# Altium project Firewatch.PrjPcb
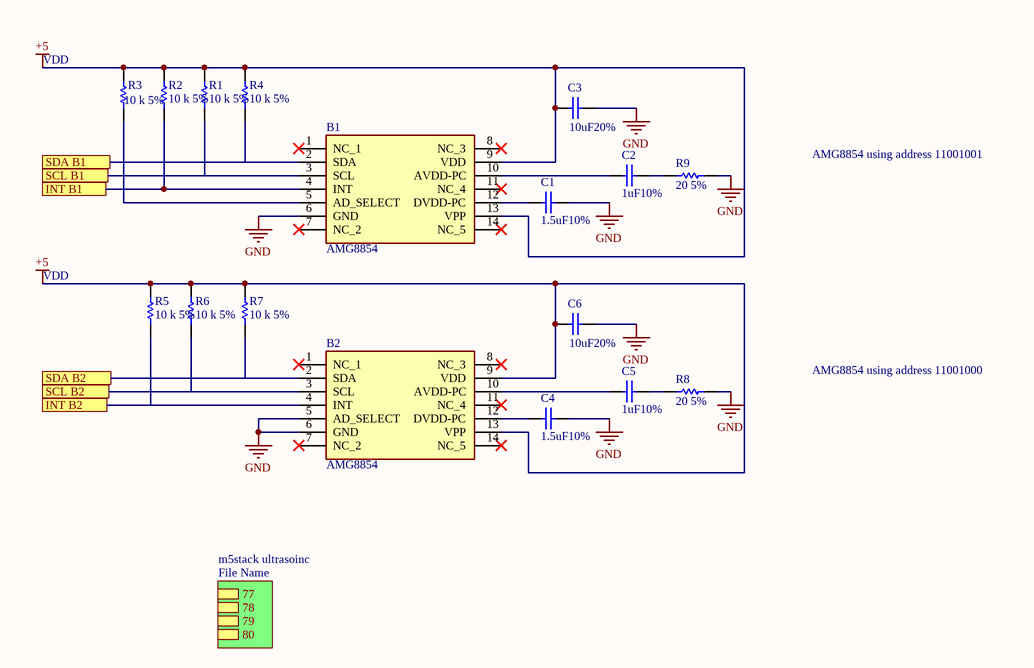
[diagram p0: Grideye.SchDoc]
6 sheets, 42 parts. Net scope: hierarchical (ports join the sheet entries above them; power ports are global).
Board file: PCB1.PcbDoc
Sheets:
  Grideye.SchDoc
  BoschIMU.SchDoc
  MicrochipUWB.SchDoc
  ublox_GPS.SchDoc
  pressure.SchDoc
  ublox_wifi.SchDoc

## Sheet Grideye.SchDoc
size A4; SheetNumber: 1; SheetTotal: 8

### Parts
B1  AMG8854  [AMG8854]
B2  AMG8854  [AMG8854]
C1  value 1.5uF10%  (hidden comment: Capacitor)
C2  value 1uF10%  (hidden comment: Capacitor)
C3  value 10uF20%  (hidden comment: Capacitor)
C4  value 1.5uF10%  (hidden comment: Capacitor)
C5  value 1uF10%  (hidden comment: Capacitor)
C6  value 10uF20%  (hidden comment: Capacitor)
R1  value 10 k 5%  (hidden comment: Resistor)
R2  value 10 k 5%  (hidden comment: Resistor)
R3  value 10 k 5%  (hidden comment: Resistor)
R4  value 10 k 5%  (hidden comment: Resistor)
R5  value 10 k 5%  (hidden comment: Resistor)
R6  value 10 k 5%  (hidden comment: Resistor)
R7  value 10 k 5%  (hidden comment: Resistor)
R8  value 20 5%  (hidden comment: Resistor)
R9  value 20 5%  (hidden comment: Resistor)

### Sub-sheets
m5stack ultrasoinc = File Name (file not in this document): 77, 78, 79, 80

### Ports
INT B1, INT B2, SCL B1, SCL B2, SDA B1, SDA B2

### Nets
+5: B1.9(VDD) B1.13(VPP) B2.9(VDD) B2.13(VPP) C3.1 C6.1 R1.2 R2.2 R3.2 R4.2 R5.2 R6.2 R7.2
GND: B1.6(GND) B2.5(AD_SELECT) B2.6(GND) C1.2 C3.2 C4.2 C6.2 R8.2 R9.2
NetB1_2: B1.2(SDA) R4.1
NetB1_3: B1.3(SCL) R1.1
NetB1_4: B1.4(INT) R2.1
NetB1_5: B1.5(AD_SELECT) R3.1
NetB1_10: B1.10(AVDD-PC) C2.1
NetB1_12: B1.12(DVDD-PC) C1.1
NetB2_2: B2.2(SDA) R7.1
NetB2_3: B2.3(SCL) R6.1
NetB2_4: B2.4(INT) R5.1
NetB2_10: B2.10(AVDD-PC) C5.1
NetB2_12: B2.12(DVDD-PC) C4.1
NetC2_2: C2.2 R9.1
NetC5_2: C5.2 R8.1

Not connected (* = marked no-connect by the designer): B1 1(NC_1)* 7(NC_2)* 8(NC_3)* 11(NC_4)* 14(NC_5)*; B2 1(NC_1)* 7(NC_2)* 8(NC_3)* 11(NC_4)* 14(NC_5)*

### Notes on the sheet
- VDD
- AMG8854 using address 11001001
- AMG8854 using address 11001000

### Library data of the parts
B1 B2 = AMG8854: Product: Infrared Array Sensor Grid-EYE, Series/Type: AMG88xx (High performance type), Number of pixel: 64 (Vertical 8 x Horizontal 8 Matrix), Operating voltage (DC) (V): 5, Viewing angle (): 60, Amplification factor: Low gain, Mounting form: Surface Mount Type; Manufacturer_Name: Panasonic; Geometry.Height: 4.3mm; Mouser Part Number: 667-AMG8854; Mouser Price/Stock: https://www.mouser.co.uk/ProductDetail/Panasonic/AMG8854?qs=sSYV1F9c5cGiWvzHDbpBOw%3D%3D; Manufacturer_Part_Number: AMG8854; Datasheet Link: https://industrial.panasonic.com/cdbs/www-data/pdf/ADI8000/ADI8000C66.pdf
C1-C6 = Capacitor: SimulationGenericComponent: True
R1-R9 = Resistor: TC1: 0; SimulationGenericComponent: True; TC2: 0

## Sheet BoschIMU.SchDoc
size A4; SheetNumber: 3; SheetTotal: 6
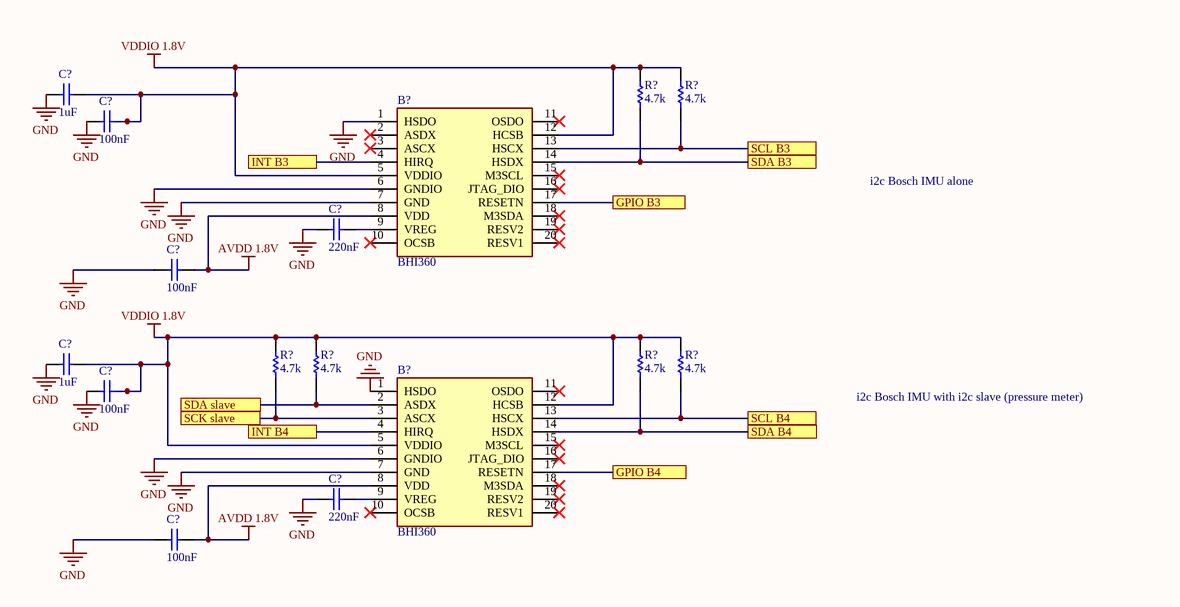
[diagram p1: BoschIMU.SchDoc]

### Parts
(Parts that share a designator on the sheet are numbered #1, #2 ... from top to bottom, then left to right.)
B?#1  BHI360  [BHI360]
B?#2  BHI360  [BHI360]
C?#1  value 1uF  (hidden comment: Capacitor)
C?#2  value 100nF  (hidden comment: Capacitor)
C?#3  value 220nF  (hidden comment: Capacitor)
C?#4  value 100nF  (hidden comment: Capacitor)
C?#5  value 1uF  (hidden comment: Capacitor)
C?#6  value 100nF  (hidden comment: Capacitor)
C?#7  value 220nF  (hidden comment: Capacitor)
C?#8  value 100nF  (hidden comment: Capacitor)
R?#1  value 4.7k  (hidden comment: Resistor)
R?#2  value 4.7k  (hidden comment: Resistor)
R?#3  value 4.7k  (hidden comment: Resistor)
R?#4  value 4.7k  (hidden comment: Resistor)
R?#5  value 4.7k  (hidden comment: Resistor)
R?#6  value 4.7k  (hidden comment: Resistor)

### Ports
GPIO B3, GPIO B4, INT B3, INT B4, SCK slave, SCL B3, SCL B4, SDA B3, SDA B4, SDA slave

### Nets
AVDD 1.8V: B?#1.8(VDD) B?#2.8(VDD) C?#4.2 C?#8.2
GND: B?#1.1(HSDO) B?#1.6(GNDIO) B?#1.7(GND) B?#2.1(HSDO) B?#2.6(GNDIO) B?#2.7(GND) C?#1.1 C?#2.1 C?#3.1 C?#4.1 C?#5.1 C?#6.1 C?#7.1 C?#8.1
VDDIO 1.8V: B?#1.5(VDDIO) B?#1.12(HCSB) B?#2.5(VDDIO) B?#2.12(HCSB) C?#1.2 C?#2.2 C?#5.2 C?#6.2 R?#1.2 R?#2.2 R?#3.2 R?#4.2 R?#5.2 R?#6.2
NetB?#1_4: B?#1.4(HIRQ) ; port INT B3
NetB?#1_9: B?#1.9(VREG) C?#3.2
NetB?#1_13: B?#1.13(HSCX) R?#2.1 ; port SCL B3
NetB?#1_14: B?#1.14(HSDX) R?#1.1 ; port SDA B3
NetB?#1_17: B?#1.17(RESETN) ; port GPIO B3
NetB?#2_2: B?#2.2(ASDX) R?#4.1 ; port SDA slave
NetB?#2_3: B?#2.3(ASCX) R?#3.1 ; port SCK slave
NetB?#2_4: B?#2.4(HIRQ) ; port INT B4
NetB?#2_9: B?#2.9(VREG) C?#7.2
NetB?#2_13: B?#2.13(HSCX) R?#6.1 ; port SCL B4
NetB?#2_14: B?#2.14(HSDX) R?#5.1 ; port SDA B4
NetB?#2_17: B?#2.17(RESETN) ; port GPIO B4

Not connected (* = marked no-connect by the designer): B?#1 2(ASDX)* 3(ASCX)* 10(OCSB)* 11(OSDO)* 15(M3SCL)* 16(JTAG_DIO)* 18(M3SDA)* 19(RESV2)* 20(RESV1)*; B?#2 10(OCSB)* 11(OSDO)* 15(M3SCL)* 16(JTAG_DIO)* 18(M3SDA)* 19(RESV2)* 20(RESV1)*

### Notes on the sheet
- i2c Bosch IMU alone
- i2c Bosch IMU with i2c slave (pressure meter)

### Library data of the parts
B?#1 B?#2 = BHI360: IMUs - Inertial Measurement Units Programmable smart sensor combining accelerometer, gyroscope and fusion software; Manufacturer_Name: BOSCH; Geometry.Height: 1mm; Mouser Part Number: 262-BHI360; Mouser Price/Stock: https://www.mouser.co.uk/ProductDetail/Bosch-Sensortec/BHI360?qs=ulEaXIWI0c93cz3Dqv%252BGgg%3D%3D; Manufacturer_Part_Number: BHI360; Datasheet Link: https://www.bosch-sensortec.com/media/boschsensortec/downloads/datasheets/bst-bhi360-ds000.pdf
C?#1-C?#8 = Capacitor: SimulationGenericComponent: True
R?#1-R?#6 = Resistor: TC1: 0; SimulationGenericComponent: True; TC2: 0

## Sheet MicrochipUWB.SchDoc
size A4; SheetNumber: 4; SheetTotal: 6
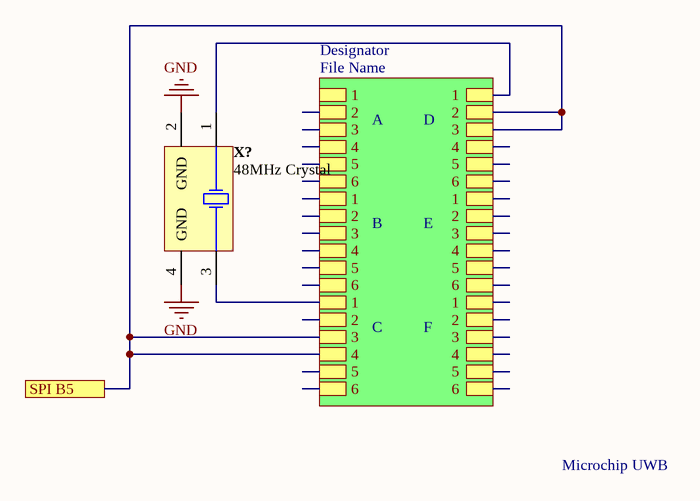
[diagram p2: MicrochipUWB.SchDoc]

### Parts
X?  48MHz Crystal  [ABRA-ABM3B-4_V]

### Sub-sheets
Designator = File Name (file not in this document): 4, 5, 6, 1, 2, 3, 4, 5, 6, 1, 2, 3, 4, 5, 6, 1, 2, 3, 4, 5, 6, 1, 2, 3, 4, 5, 6, 1, 2, 3, 4, 5, 6, 1, 2, 3

### Ports
SPI B5

### Nets
GND: X?.2(GND) X?.4(GND)
NetX?_1: X?.1(X1) ; sheet Designator/1
NetX?_3: X?.3(X2) ; sheet Designator/1
(unnamed): port SPI B5, sheet Designator/3, sheet Designator/4, sheet Designator/2, sheet Designator/3

### Notes on the sheet
- A
- D
- B
- E
- C
- F
- Microchip UWB

### Library data of the parts
X? = CMP-003-00019-2: Ceramic SMD Crystal, 24 MHz, +/- 20 ppm, 18 pF, -20 to 70 degC, 4-Pin SMD, RoHS, Tape and Reel; Manufacturer: Abracon; Load Capacitance: 18pF; Frequency Tolerance: 20ppm; ESR: 50; Resistance: 50Ohm; Frequency: 24MHz; Package Quantity: 1000; Packaging: TapeandReel; RoHS Compliant: True; Package Description: 4-Pin Surface Mount Device, Body 5 x 3.2 mm; Mounting Technology: SM; Pins: 4; Datasheet URL: http://www.abracon.com/Resonators/abm3b.pdf; Tolerance: 20ppm; Manufacturer URL: http://www.abracon.com/; Max Operating Temperature: 70°C; Datasheet Version: Aug-15; Min Operating Temperature: -20°C; Package Reference: ABM3B; Case/Package: CSMD

## Sheet ublox_GPS.SchDoc
size A4; SheetNumber: 5; SheetTotal: 6
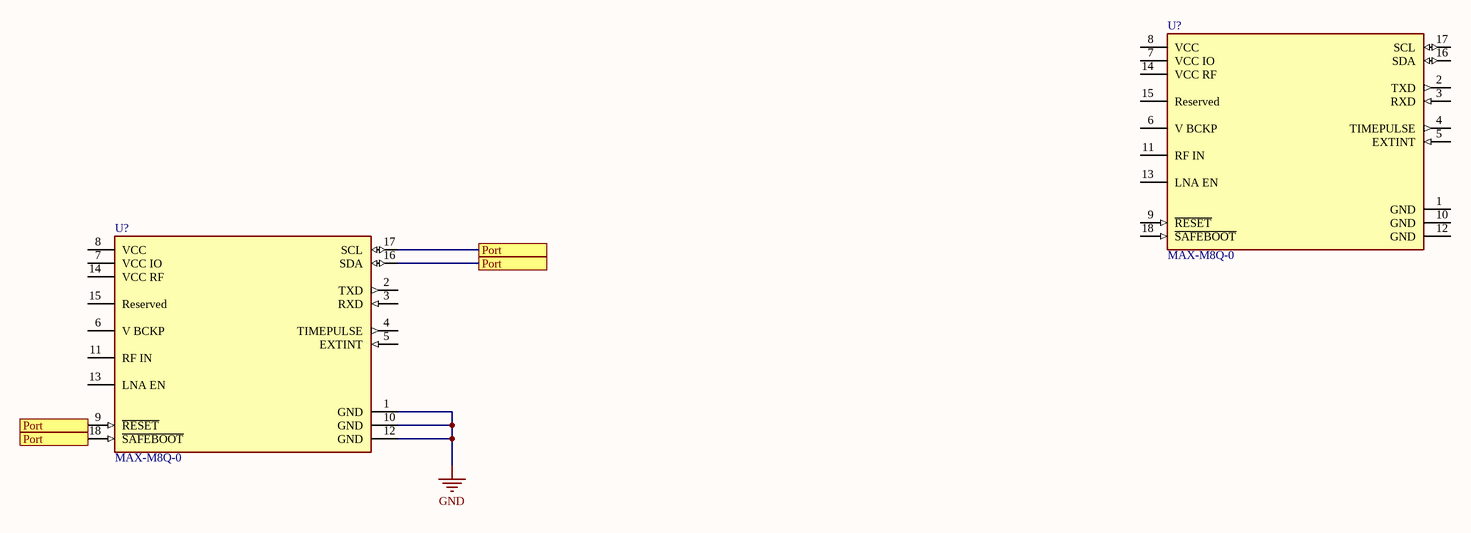
[diagram p3: ublox_GPS.SchDoc]

### Parts
(Parts that share a designator on the sheet are numbered #1, #2 ... from top to bottom, then left to right.)
U?#1  MAX-M8Q-0  [FP-MAX-M8Q-0-MFG]
U?#2  MAX-M8Q-0  [FP-MAX-M8Q-0-MFG]

### Ports
Port

### Nets
GND: U?#2.1(GND) U?#2.10(GND) U?#2.12(GND)
NetU?#2_9: U?#2.9(~{RESET}) U?#2.16(SDA) U?#2.17(SCL) U?#2.18(~{SAFEBOOT}) ; port Port

Not connected (* = marked no-connect by the designer): U?#1 1(GND) 2(TXD) 3(RXD) 4(TIMEPULSE) 5(EXTINT) 6(V_BCKP) 7(VCC_IO) 8(VCC) 9(~{RESET}) 10(GND) 11(RF_IN) 12(GND) 13(LNA_EN) 14(VCC_RF) 15(Reserved) 16(SDA) 17(SCL) 18(~{SAFEBOOT}); U?#2 2(TXD) 3(RXD) 4(TIMEPULSE) 5(EXTINT) 6(V_BCKP) 7(VCC_IO) 8(VCC) 11(RF_IN) 13(LNA_EN) 14(VCC_RF) 15(Reserved)

### Library data of the parts
U?#1 U?#2 = CMP-207130-000017-1: RF RCVR GNSS/GPS 1.575GHZ 18LCC; Sensitivity: -167dBm; Current - Receiving: 23mA; Interface: I2C; Frequency: 1.575GHz; Min Operating Temperature: -40°C; Case/Package: SMD/SMT; RoHS Compliant: Yes; Packaging: Cut Tape; Max Operating Temperature: 85°C

## Sheet pressure.SchDoc
size A4; SheetNumber: 6; SheetTotal: 6
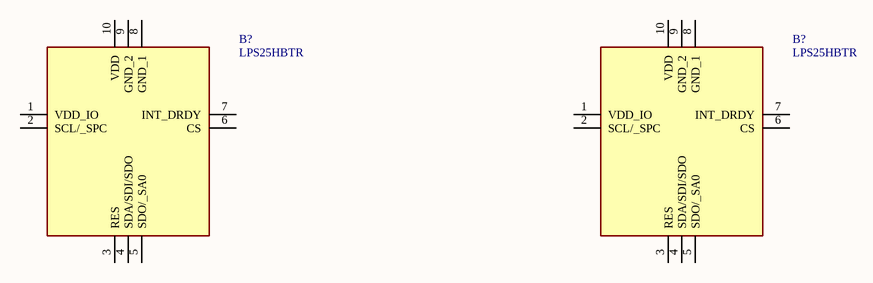
[diagram p4: pressure.SchDoc]

### Parts
(Parts that share a designator on the sheet are numbered #1, #2 ... from top to bottom, then left to right.)
B?#3  LPS25HBTR  [LPS25HBTR]
B?#4  LPS25HBTR  [LPS25HBTR]

### Nets

Not connected (* = marked no-connect by the designer): B?#3 1(VDD_IO) 2(SCL/_SPC) 3(RES) 4(SDA/SDI/SDO) 5(SDO/_SA0) 6(CS) 7(INT_DRDY) 8(GND_1) 9(GND_2) 10(VDD); B?#4 1(VDD_IO) 2(SCL/_SPC) 3(RES) 4(SDA/SDI/SDO) 5(SDO/_SA0) 6(CS) 7(INT_DRDY) 8(GND_1) 9(GND_2) 10(VDD)

### Library data of the parts
B?#3 B?#4 = LPS25HBTR: Board Mount Pressure Sensor 26kPa to 126kPa Absolute 10-Pin HLGA T/R; Manufacturer_Name: STMicroelectronics; Geometry.Height: 0.8mm; Mouser Part Number: 511-LPS25HBTR; Mouser Price/Stock: https://www.mouser.co.uk/ProductDetail/STMicroelectronics/LPS25HBTR?qs=GDOUxV2YAh9IvjPyBKWGzQ%3D%3D; Manufacturer_Part_Number: LPS25HBTR; Datasheet Link: https://www.st.com/resource/en/datasheet/lps25hb.pdf

## Sheet ublox_wifi.SchDoc
size A4; SheetNumber: 8; SheetTotal: 8
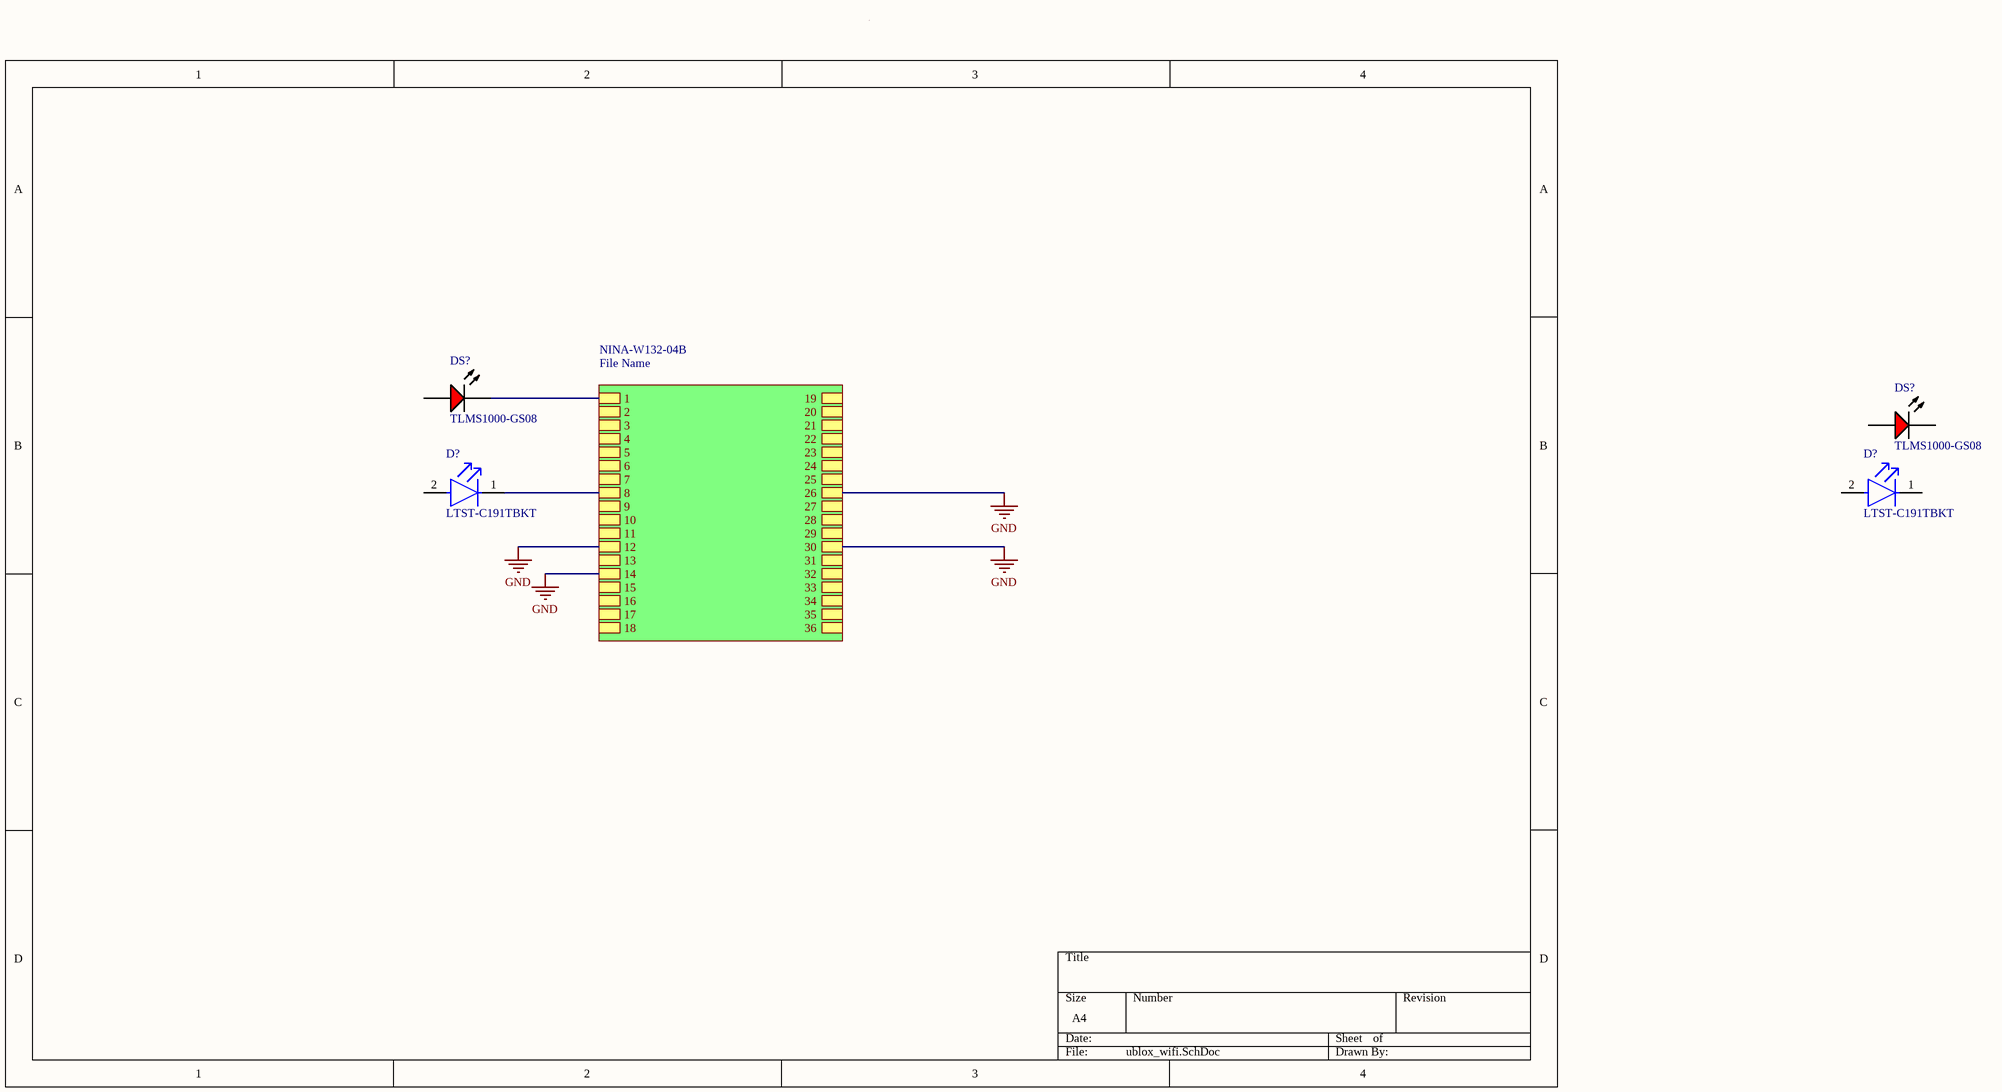
[diagram p5: ublox_wifi.SchDoc]

### Parts
(Parts that share a designator on the sheet are numbered #1, #2 ... from top to bottom, then left to right.)
D?#1  LTST-C191TBKT  [FP-LTST-C191TBKT-MFG]
D?#2  LTST-C191TBKT  [FP-LTST-C191TBKT-MFG]
DS?#1  TLMS1000-GS08  [VISH-TLMS1000_V]
DS?#2  TLMS1000-GS08  [VISH-TLMS1000_V]

### Sub-sheets
NINA-W132-04B = File Name (file not in this document): 1, 2, 3, 4, 5, 6, 7, 8, 9, 10, 11, 12, 13, 14, 16, 15, 17, 18, 19, 20, 21, 22, 23, 24, 25, 26, 27, 28, 29, 30, 31, 32, 33, 34, 35, 36

### Nets
GND: sheet NINA-W132-04B/12, sheet NINA-W132-04B/14, sheet NINA-W132-04B/26, sheet NINA-W132-04B/30
NetD?#1_1: D?#1.1(C) ; sheet NINA-W132-04B/8
NetDS?#1_2: DS?#1.2(K) ; sheet NINA-W132-04B/1

Not connected (* = marked no-connect by the designer): D?#1 2(A); D?#2 1(C) 2(A); DS?#1 1(A); DS?#2 1(A) 2(K)

### Library data of the parts
D?#1 D?#2 = CMP-22017-000008-1: LED BLUE CLEAR CHIP SMD; Lens Color: Colorless; Dominant Wavelength: 475nm; Forward Current: 20mA; Wavelength: 468nm; Viewing Angle: 130°; Power Dissipation: 76mW; Luminous Intensity: 180mcd; Reverse Voltage: 5V; Number of Elements: 1; Lens Style: Diffused; Forward Voltage: 3.8V; Max Power Dissipation: 75mW; Case Code (Metric): 1608; Packaging: Tape and Reel; Case/Package: 0603; Depth: 1.6mm; Mount: Surface Mount; Lead Free: Lead Free; Min Operating Temperature: -20°C; Lens Transparency: Clear; Illumination Color: Blue; Height: 0.55mm; Test Current: 20mA; Case Code (Imperial): 0603; Max Operating Temperature: 80°C; Number of Pins: 2; Length: 0.8mm; Radiation Hardening: No; Package Quantity: 1; Number of LEDs: 1; Width: 0.8mm; Color: Blue
DS?#1 DS?#2 = CMP-2000-07254-1: Low Current LED, 40 mW, 1.8 V, -40 to 100 degC, 2-Pin SMD (0603), RoHS, Tape and Reel; Manufacturer: Vishay; Lens Shape: Rectangular; Automotive Qualification Standard: AEC-Q100; Wavelength Typ: 636nm; SVHC: ToBeAdvised; LED Colour: Red; Bulb Size: 1.6mmx0.8mm; Forward Voltage: 1.8V; Luminous Intensity: 4mcd; Forward Current If: 2mA; Viewing Angle: 80°; Datasheet Version: Rev. 1.7, 02/2011; Datasheet URL: https://datasheet.ciiva.com/5798/1698881-5798337.pdf; LED Mounting: SMD; Packaging: CutTape; Package Reference: TLMS1000; Manufacturer URL: http://www.vishay.com/; Mounting Technology: SurfaceMount; Product Range: -; Package Description: 2-Pin Surface Mount Device, Body 1.6 x 0.8 mm; MSL: MSL2-1year

## Nets that join several sheets
GND: Grideye (9 pins), BoschIMU (14 pins), MicrochipUWB (X?.2 X?.4), ublox_GPS (U?#2.1 U?#2.10 U?#2.12)